# EAGLE design Killswitch (EAGLE 6.6.0)
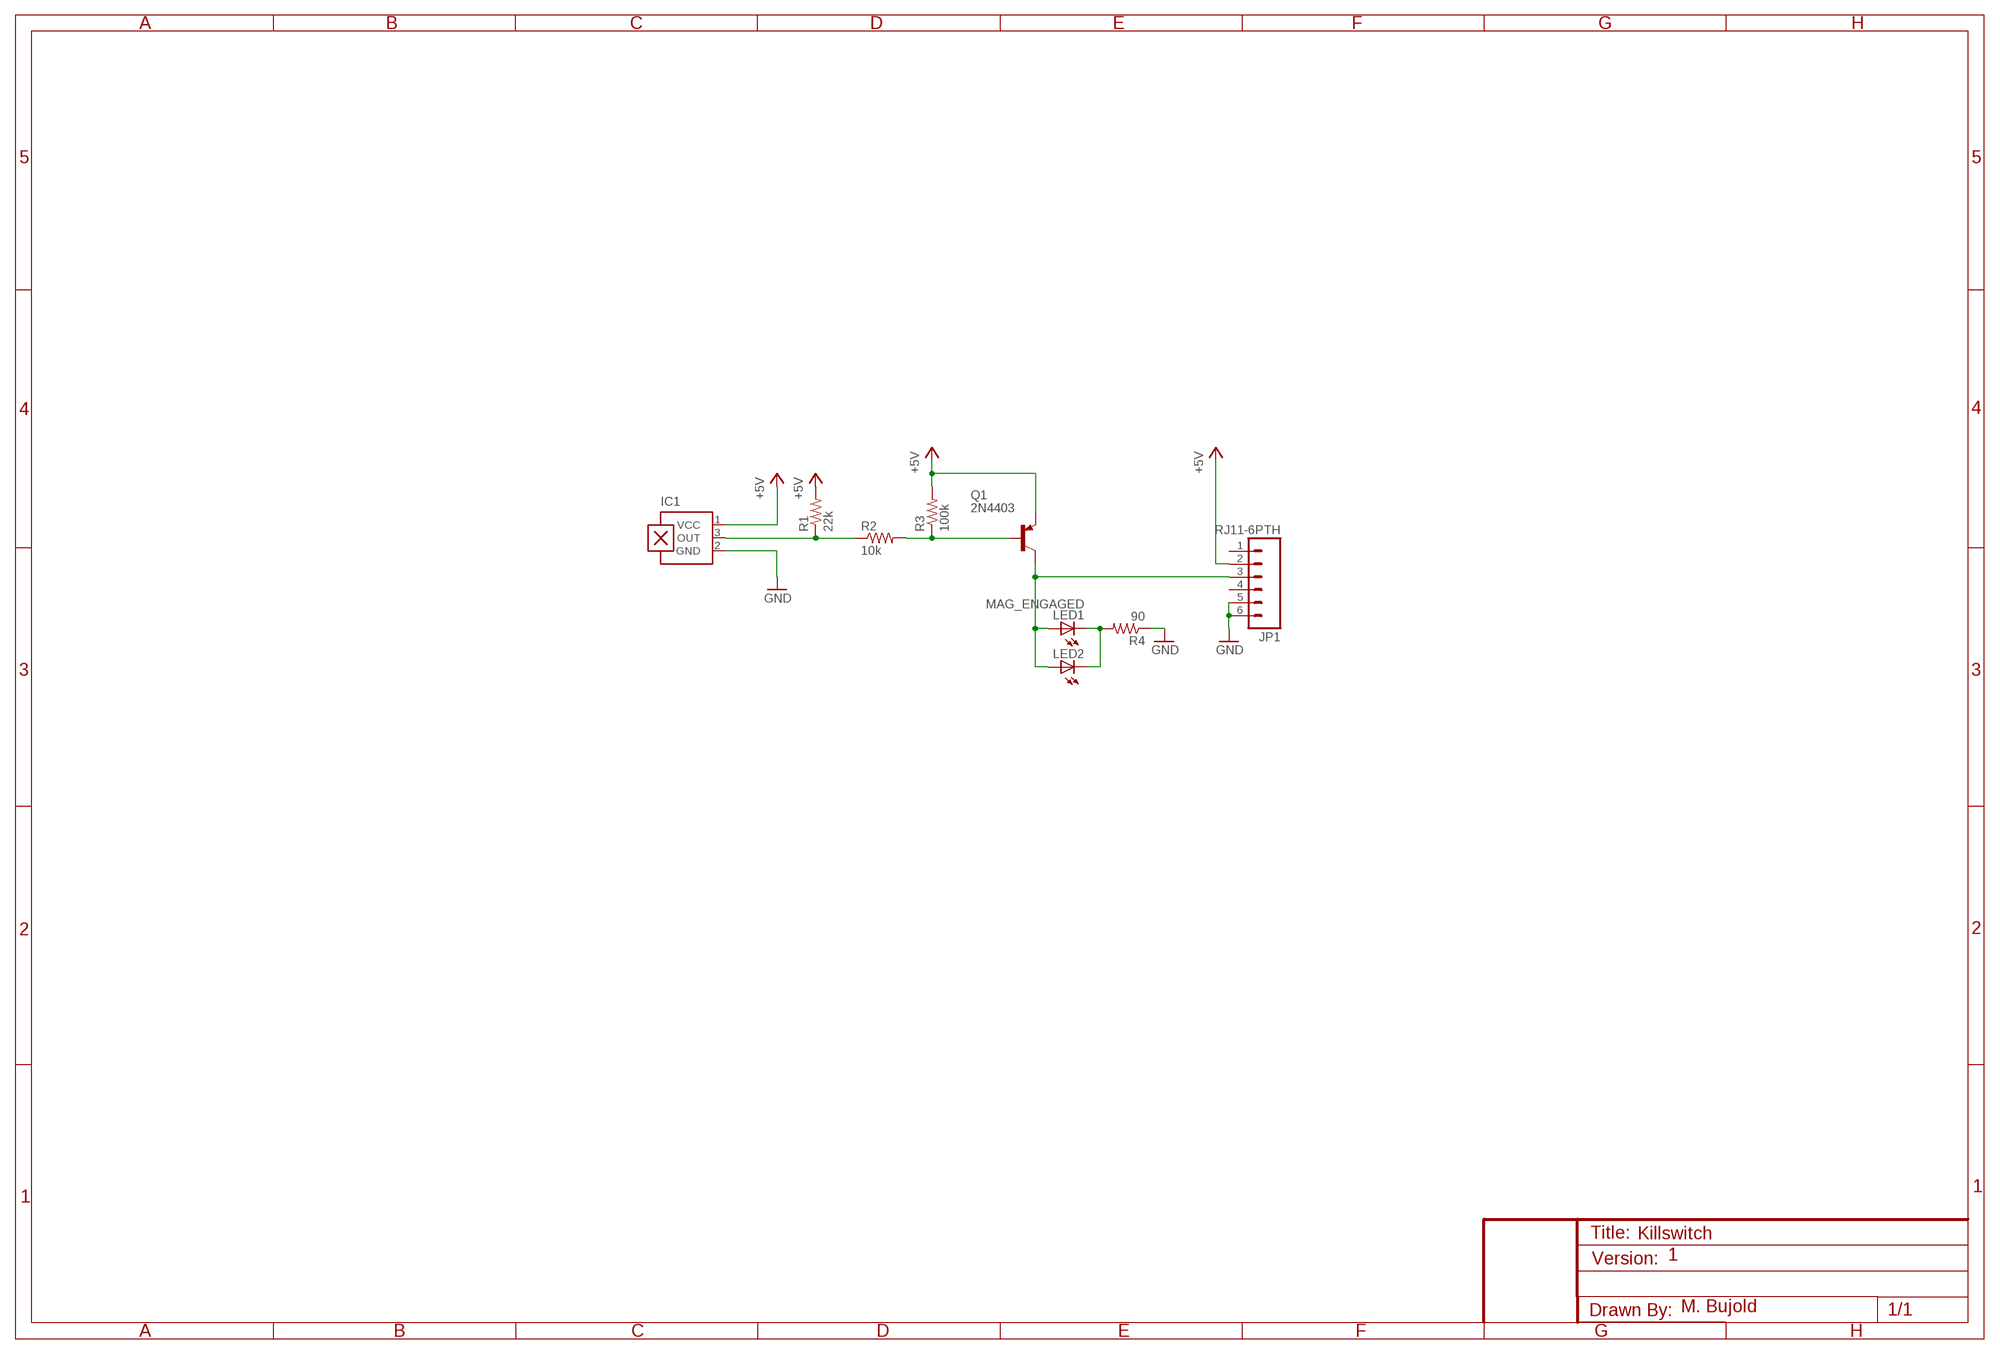
[diagram p0: schematic, sheet 1]

## Parts
IC1  A1384UA  [SIP3-UA]
JP1  RJ11-6PTH  [RJ11-6]
LED1  MAG_ENGAGED  LEDCHIPLED_1206  [CHIPLED_1206]
LED2  LED3MM  [LED3MM]
Q1  2N4403  2N3906  [TO92]
R1  22k  RESISTOR1206  [1206]
R2  10k  RESISTOR1206  [1206]
R3  100k  RESISTOR1206  [1206]
R4  90  RESISTOR1206  [1206]

## Nets
+5V: IC1.1(VCC) JP1.2 Q1.3(E) R1.2 R3.2
GND: IC1.2(GND) JP1.5 JP1.6 R4.1
N$1: IC1.3(OUT) R1.1 R2.1
N$2: Q1.2(B) R2.2 R3.1
N$3: LED1.C LED2.K(C) R4.2
N$4: JP1.3 LED1.A LED2.A Q1.1(C)
Unconnected: JP1.1 JP1.4

## Notes on the sheet
- 1
- M. Bujold

## Library data of the parts
IC1 = allegro:A13*?: Linear Hall Effect Sensor ICs Continuous-Time Ratiometric High-Temperature Operation Programmable Linear with Analog Output A1302 -Replacement- UGN3503 Source: http://www.allegromicro.com/en/Products/Part_Numbers/1301/1301.pdf http://www.allegromicro.com/en/Products/Part_Numbers/1321/1321.pdf http://www.allegromicro.com/en/Products/Part_Numbers/1381/1381.pdf; MPN: A1384LUA-T; OC_FARNELL: unknown; OC_NEWARK: 30M9961
JP1 = SparkFun-Connectors:RJ11-6: RJ11 Jack Simple 6 pin RJ11 jack. Commonly found on CAT3 devices and Microchip programmers. SKU: PRT-00132
LED1 LED2 = adafruit:LED: LED OSRAM: - CHIPLED LG R971, LG N971, LY N971, LG Q971, LY Q971, LO R971, LY R971 LH N974, LH R974 LS Q976, LO Q976, LY Q976 LO Q996 - Hyper CHIPLED LW Q18S LB Q993, LB Q99A, LB R99A - SideLED LS A670, LO A670, LY A670, LG A670, LP A670 LB A673, LV A673, LT A673, LW A673 LH A674 LY A675 LS A676, LA A676, LO A676, LY A676, LW A676 LS A679, LY A679, LG A679 - Hyper Micro SIDELED® LS Y876, LA Y876, LO Y876, LY Y876 LT Y87S - SmartLED LW L88C, LW L88S LB L89C, LB L89S, LG L890 LS L89K, LO L89K, LY L89K LS L896, LA L896, LO L896, LY L896 - TOPLED LS T670, LO T670, LY T670, LG T670, LP T670 LSG T670, LSP T670, LSY T670, LOP T670, LYG T670 LG T671, LOG T671, LSG T671 LB T673, LV T673, LT T673, LW T673 LH T674 LS T676, LA T676, LO T676, LY T676, LB T676, LH T676, LSB T676, LW T676 LB T67C, LV T67C, LT T67C, LS T67K, LO T67K, LY T67K, LW E67C LS E67B, LA E67B, LO E67B, LY E67B, LB E67C, LV E67C, LT E67C LW T67C LS T679, LY T679, LG T679 LS T770, LO T770, LY T770, LG T770, LP T770 LB T773, LV T773, LT T773, LW T773 LH T774 LS E675, LA E675, LY E675, LS T675 LS T776, LA T776, LO T776, LY T776, LB T776 LHGB T686 LT T68C, LB T68C - Hyper Mini TOPLED® LB M676 - Mini TOPLED Santana® LG M470 LS M47K, LO M47K, LY M47K Source: http://www.osram.convergy.de/
Q1 = transistor-pnp:2N3906: PNP Transistor
R1-R4 = SparkFun-Passives:RESISTOR: Resistor Basic schematic elements and footprints for 0603, 1206, and PTH resistors.

## Board
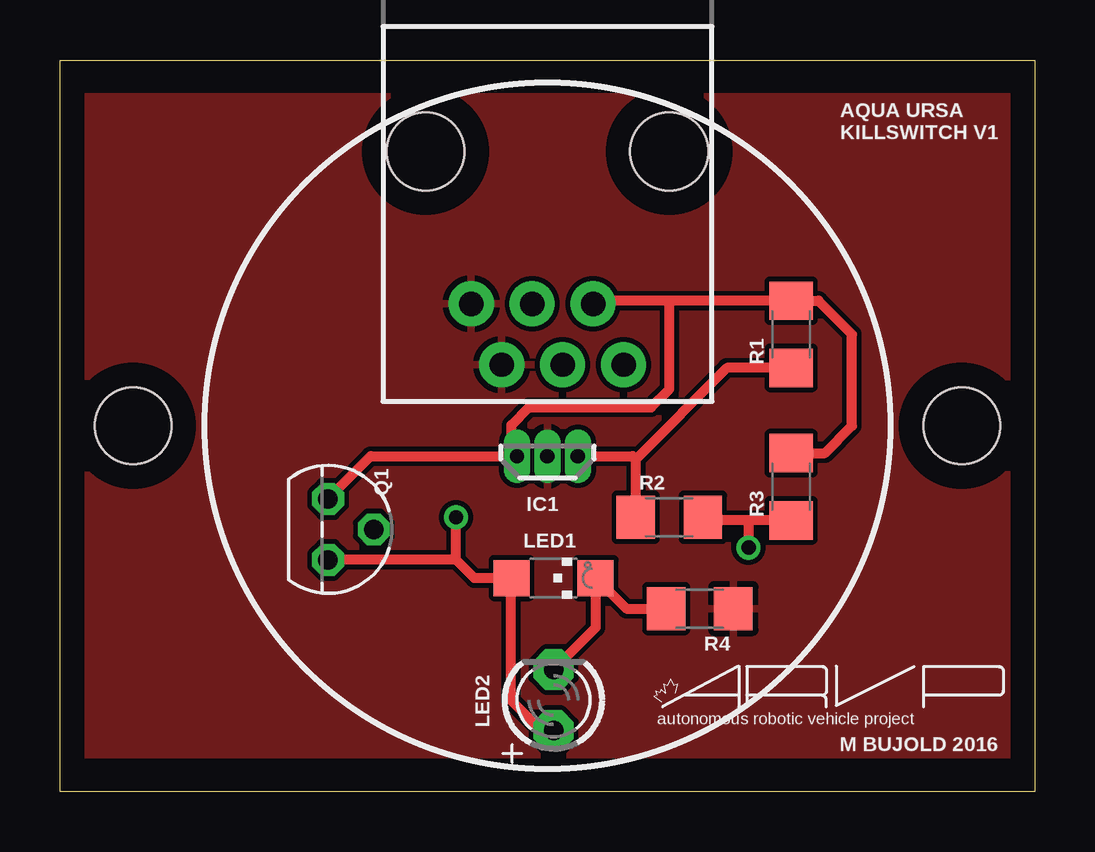
[diagram p1: board, top side]
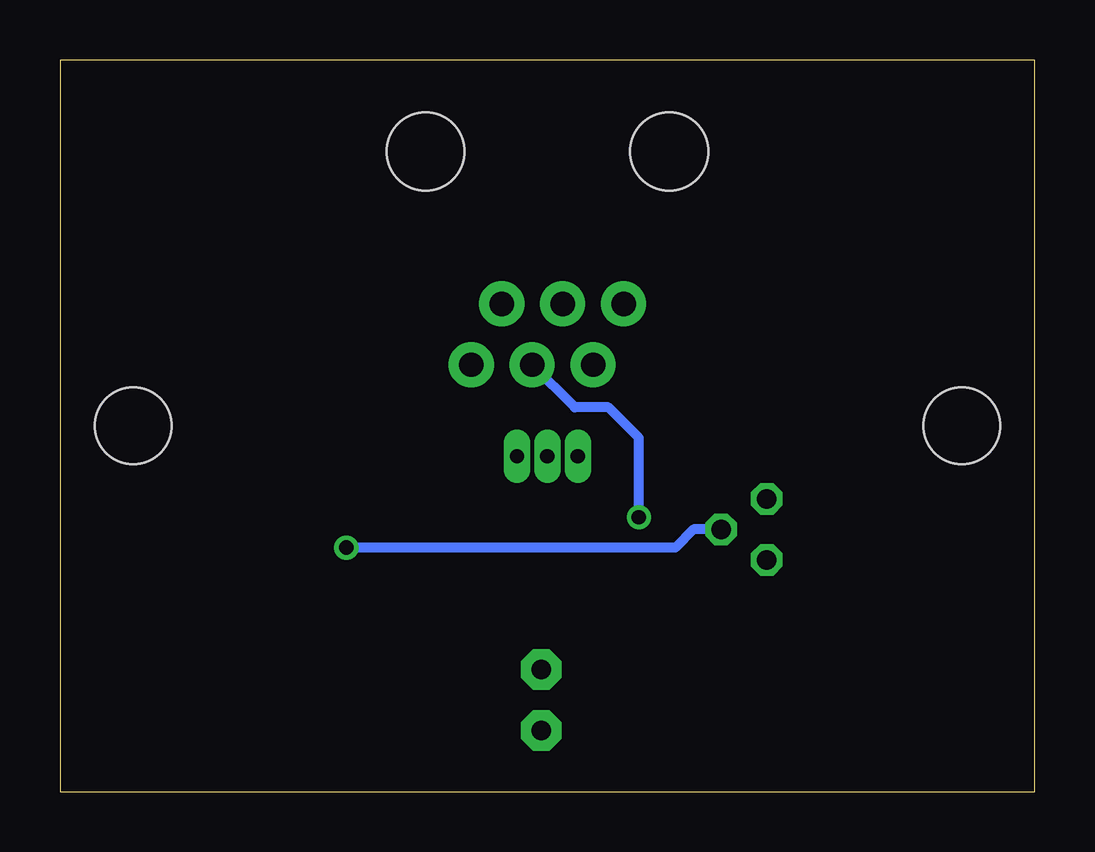
[diagram p2: board, bottom side, seen from below]

Size 40.64 x 30.48 mm. Coordinates in mm from the lower left corner, seen from the top.
Outline: 40.64,30.48 40.64,0 0,0 0,30.48 40.64,30.48
Copper layers (1*16): Top 0.035mm / dielectric 1.5mm / Bottom 0.035mm
Design rules "default": minimum track width 10mil, minimum drill 24mil, track to track 8mil, track to pad 8mil, pad to pad 8mil, via to via 8mil, smd to smd 8mil, copper to edge 40mil, drill to drill 8mil, minimum pad ring 10mil, minimum via ring 8mil, stop-mask expansion 4mil, vias tented up to drill 0mil, thermal gap 10mil
Holes 3.2 mm at 3.05,15.24 37.59,15.24

### Footprints (pad centres in the part's own frame; a part is rotated, then mirrored left to right if it is on the bottom)
SIP3-UA = drill 0.6 pad 0.7 long: 1 -1.27,0; 2 0,0; 3 1.27,0
RJ11-6 = drill 1.016 pad 1.88: 1 1.905,8.89; 2 3.175,6.35; 3 4.445,8.89; 4 5.715,6.35; 5 6.985,8.89; 6 8.255,6.35 | hole 3.251: 0,0; 10.16,0
CHIPLED_1206 = smd 1.5 x 1.5: A 0,-1.75; C 0,1.75
LED3MM = drill 0.813 pad 1.676 octagon: A -1.27,0; K 1.27,0
TO92 = drill 0.813 octagon: 1 1.27,0; 2 0,1.905; 3 -1.27,0
1206 = smd 1.6 x 1.8: 1 -1.4,0; 2 1.4,0

### Placement (x,y rotation side)
IC1  20.32,13.97 0 top
JP1  25.4,26.67 180 top
LED1  20.57,8.89 270 top
LED2  20.57,3.81 90 top
Q1  11.18,10.92 270 top
R1  30.48,19.05 90 top
R2  25.4,11.43 0 top
R3  30.48,12.7 90 top
R4  26.67,7.62 180 top
U$1  [ARVP]  24.89,2.79 0 top

### Tracks (layer width: path | path; a pad name or v marks a point on that pad's centre or on a via)
+5V
  Top 0.406: 25.4,20.45 R1.2 31.62,20.45 33.02,19.05 33.02,15.24 31.88,14.1 R3.2 | 25.4,20.45 22.36,20.45 JP1.2 | 25.4,20.45 25.4,16.76 24.64,16 19.56,16 18.82,15.27 18.82,14.2 IC1.1 12.95,13.97 Q1.3
GND
  Top 0.406: 17.02,20.45 JP1.6
  pour Top: 0.51,28.96 40.13,28.96 40.13,1.52 0.51,1.52
N$1
  Top 0.406: R2.1 24,13.84 | 24,13.84 27.81,17.65 R1.1 | IC1.3 23.87,13.97 24,13.84
N$2  (via drill 0.6)
  Top 0.406: R3.1 28.7,11.3 | 28.7,11.3 26.93,11.3 R2.2 26.67,11.3 | 28.7,11.3 v28.7,10.16
  Bottom 0.406: Q1.2 14.22,10.92 14.99,10.16 v28.7,10.16
N$3
  Top 0.406: R4.2 23.62,7.62 22.35,8.89 LED1.C 22.32,6.83 LED2.K
N$4  (via drill 0.6)
  Top 0.406: LED2.A 20.07,2.54 18.8,3.81 18.8,8.86 LED1.A 17.27,8.89 16.51,9.65 | 16.51,9.65 v16.51,11.43 | 16.51,9.65 Q1.1
  Bottom 0.406: v16.51,11.43 16.51,14.73 17.78,16 19.18,16 JP1.3

### Text on the board
tNames: AQUA URSA / KILLSWITCH V1 | M BUJOLD 2016